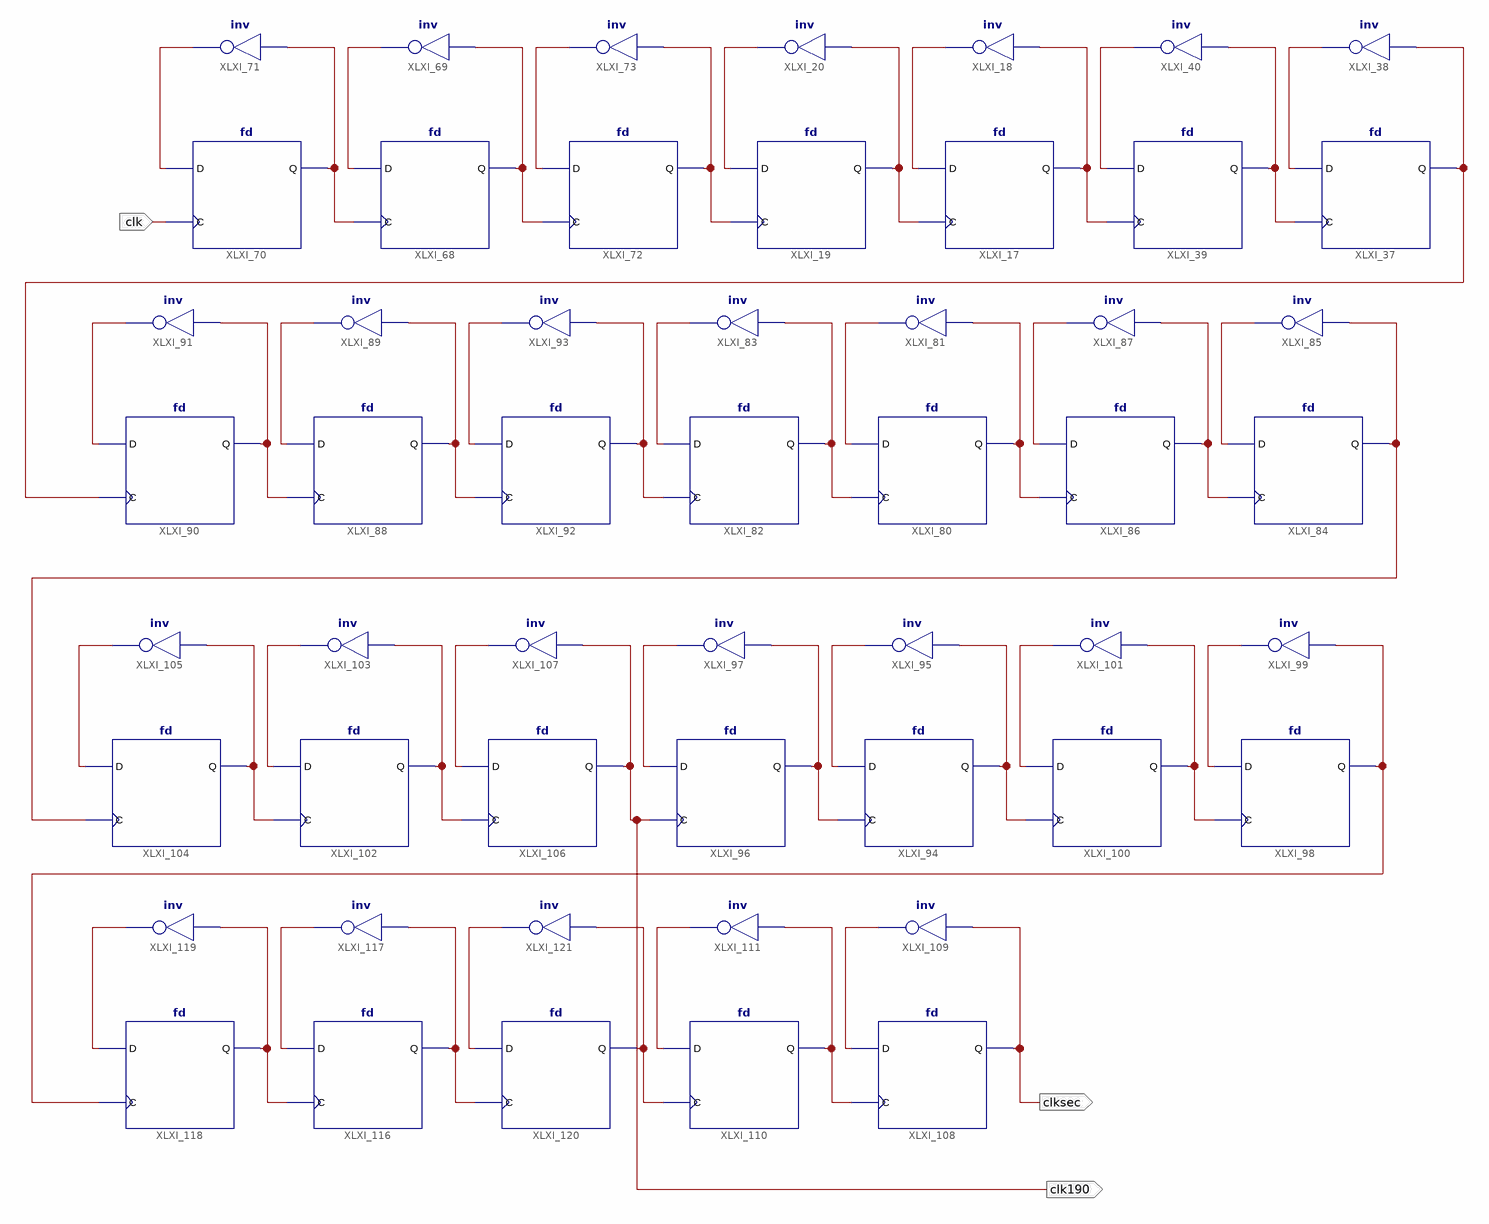
[diagram p0: schematic sheet 1]
// Xilinx ISE schematic clkdiv.sch (spartan3e) as structural Verilog: 52 symbols, 3 ports
module clkdiv (
  input  clk,
  output clksec,
  output clk190
);

  wire XLXN_32, XLXN_33, XLXN_59, XLXN_60, XLXN_61, XLXN_84, XLXN_85, XLXN_87, XLXN_98, XLXN_99, XLXN_100,
       XLXN_101, XLXN_102, XLXN_103, XLXN_111, XLXN_112, XLXN_113, XLXN_114, XLXN_115, XLXN_116, XLXN_117,
       XLXN_118, XLXN_119, XLXN_120, XLXN_121, XLXN_122, XLXN_123, XLXN_127, XLXN_128, XLXN_129, XLXN_130,
       XLXN_131, XLXN_132, XLXN_133, XLXN_134, XLXN_135, XLXN_136, XLXN_137, XLXN_138, XLXN_139, XLXN_142,
       XLXN_143, XLXN_144, XLXN_147, XLXN_150, XLXN_151, XLXN_152, XLXN_153, XLXN_154, XLXN_155;

  fd XLXI_17 (.C(XLXN_84), .D(XLXN_32), .Q(XLXN_85));
  not XLXI_18 (XLXN_32, XLXN_85);
  fd XLXI_19 (.C(XLXN_103), .D(XLXN_33), .Q(XLXN_84));
  not XLXI_20 (XLXN_33, XLXN_84);
  fd XLXI_37 (.C(XLXN_87), .D(XLXN_59), .Q(XLXN_60));
  not XLXI_38 (XLXN_59, XLXN_60);
  fd XLXI_39 (.C(XLXN_85), .D(XLXN_61), .Q(XLXN_87));
  not XLXI_40 (XLXN_61, XLXN_87);
  fd XLXI_68 (.C(XLXN_101), .D(XLXN_98), .Q(XLXN_102));
  not XLXI_69 (XLXN_98, XLXN_102);
  fd XLXI_70 (.C(clk), .D(XLXN_99), .Q(XLXN_101));
  not XLXI_71 (XLXN_99, XLXN_101);
  fd XLXI_72 (.C(XLXN_102), .D(XLXN_100), .Q(XLXN_103));
  not XLXI_73 (XLXN_100, XLXN_103);
  fd XLXI_80 (.C(XLXN_115), .D(XLXN_111), .Q(XLXN_116));
  not XLXI_81 (XLXN_111, XLXN_116);
  fd XLXI_82 (.C(XLXN_123), .D(XLXN_112), .Q(XLXN_115));
  not XLXI_83 (XLXN_112, XLXN_115);
  fd XLXI_84 (.C(XLXN_117), .D(XLXN_113), .Q(XLXN_127));
  not XLXI_85 (XLXN_113, XLXN_127);
  fd XLXI_86 (.C(XLXN_116), .D(XLXN_114), .Q(XLXN_117));
  not XLXI_87 (XLXN_114, XLXN_117);
  fd XLXI_88 (.C(XLXN_121), .D(XLXN_118), .Q(XLXN_122));
  not XLXI_89 (XLXN_118, XLXN_122);
  fd XLXI_90 (.C(XLXN_60), .D(XLXN_119), .Q(XLXN_121));
  not XLXI_91 (XLXN_119, XLXN_121);
  fd XLXI_92 (.C(XLXN_122), .D(XLXN_120), .Q(XLXN_123));
  not XLXI_93 (XLXN_120, XLXN_123);
  fd XLXI_94 (.C(XLXN_132), .D(XLXN_128), .Q(XLXN_133));
  not XLXI_95 (XLXN_128, XLXN_133);
  fd XLXI_96 (.C(clk190), .D(XLXN_129), .Q(XLXN_132));
  not XLXI_97 (XLXN_129, XLXN_132);
  fd XLXI_98 (.C(XLXN_134), .D(XLXN_130), .Q(XLXN_142));
  not XLXI_99 (XLXN_130, XLXN_142);
  fd XLXI_100 (.C(XLXN_133), .D(XLXN_131), .Q(XLXN_134));
  not XLXI_101 (XLXN_131, XLXN_134);
  fd XLXI_102 (.C(XLXN_138), .D(XLXN_135), .Q(XLXN_139));
  not XLXI_103 (XLXN_135, XLXN_139);
  fd XLXI_104 (.C(XLXN_127), .D(XLXN_136), .Q(XLXN_138));
  not XLXI_105 (XLXN_136, XLXN_138);
  fd XLXI_106 (.C(XLXN_139), .D(XLXN_137), .Q(clk190));
  not XLXI_107 (XLXN_137, clk190);
  fd XLXI_108 (.C(XLXN_147), .D(XLXN_143), .Q(clksec));
  not XLXI_109 (XLXN_143, clksec);
  fd XLXI_110 (.C(XLXN_155), .D(XLXN_144), .Q(XLXN_147));
  not XLXI_111 (XLXN_144, XLXN_147);
  fd XLXI_116 (.C(XLXN_153), .D(XLXN_150), .Q(XLXN_154));
  not XLXI_117 (XLXN_150, XLXN_154);
  fd XLXI_118 (.C(XLXN_142), .D(XLXN_151), .Q(XLXN_153));
  not XLXI_119 (XLXN_151, XLXN_153);
  fd XLXI_120 (.C(XLXN_154), .D(XLXN_152), .Q(XLXN_155));
  not XLXI_121 (XLXN_152, XLXN_155);
endmodule
